# Altium schematic sheet Sheet1.SchDoc
size A; SheetNumber: 1; SheetTotal: 1
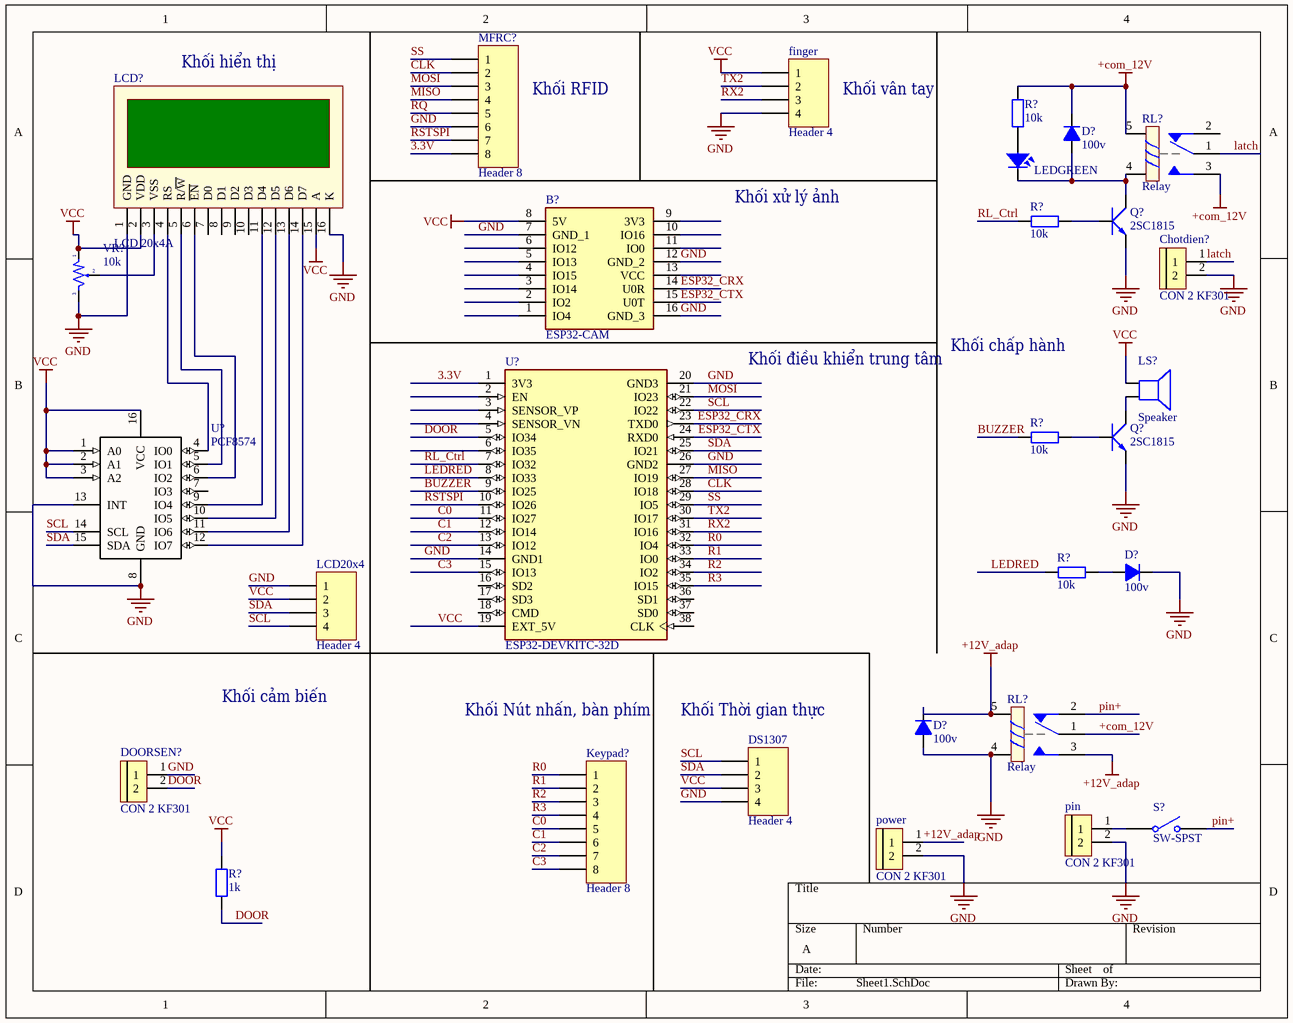
[diagram p0: Sheet1.SchDoc]

## Parts
(Parts that share a designator on the sheet are numbered #1, #2 ... from top to bottom, then left to right.)
B?  ESP32-CAM  [ESP32CAM]
Chotdien?  CON 2 KF301  [Con 2 KF301 5.08]
D?#1  100v  [DIODE 1A]
D?#2  100v  [DIODE 1A]
D?#3  100v  [DIODE 1A]
DOORSEN?  CON 2 KF301  [Con 2 KF301 5.08]
DS1307  Header 4  [HDR1X4]
finger  Header 4  [HDR1X4]
Keypad?  Header 8  [HDR1X8]
LCD20x4  Header 4  [HDR1X4]
LCD?  LCD 20x4A  [LCD20X4A]
LEDGREEN  LED  [LED-3MM-YELLOW]  (value not drawn)
LS?  Speaker  [SPEAKER]
MFRC?  Header 8  [HDR1X8]
pin  CON 2 KF301  [Con 2 KF301 5.08]
power  CON 2 KF301  [Con 2 KF301 5.08]
Q?#1  2SC1815  [TO92-123]
Q?#2  2SC1815  [TO92-123]
R?#1  10k  [tro vach 1w]
R?#2  10k  [tro vach 1w]
R?#3  10k  [tro vach 1w]
R?#4  10k  [tro vach 1w]
R?#5  1k  [tro vach 1w]
RL?#1  Relay  [Relay 5 Chan SRD]
RL?#2  Relay  [Relay 5 Chan SRD]
S?  SW-SPST  [SPST-2]
U?#1  PCF8574  [DIP16]
U?#2  ESP32-DEVKITC-32D  [MODULE_ESP32-DEVKITC-32D]
VR?  10k  [Bien Tro Volume Don]

## Nets
+12V_adap: D?#3.2(K) power.1 RL?#2.3 RL?#2.5
+com_12V: D?#1.2(K) R?#1.2 RL?#1.3 RL?#1.5 RL?#2.1
GND: B?.7(GND_1) B?.12(GND_2) B?.16(GND_3) Chotdien?.2 D?#2.2(K) D?#3.1(A) DOORSEN?.1 DS1307.4 finger.4 LCD20x4.1 LCD?.1(GND) LCD?.16(K) MFRC?.6 pin.2 power.2 Q?#1.1(E) Q?#2.1(E) RL?#2.4 U?#1.8(GND) U?#1.13(INT) U?#2.14(GND1) U?#2.20(GND3) U?#2.26(GND2) VR?.3
VCC: B?.8(5V) DS1307.3 finger.1 LCD20x4.2 LCD?.2(VDD) LCD?.15(A) LS?.1 R?#5.2 U?#1.1(A0) U?#1.2(A1) U?#1.3(A2) U?#1.16(VCC) U?#2.19(EXT_5V) VR?.1
3.3V: MFRC?.8 U?#2.1(3V3)
BUZZER: R?#3.1 U?#2.9(IO25)
C0: Keypad?.5 U?#2.11(IO27)
C1: Keypad?.6 U?#2.12(IO14)
C2: Keypad?.7 U?#2.13(IO12)
C3: Keypad?.8 U?#2.15(IO13)
CLK: MFRC?.2 U?#2.28(IO18)
DOOR: DOORSEN?.2 R?#5.1 U?#2.5(IO34)
ESP32_CRX: B?.14(U0R) U?#2.23(TXD0)
ESP32_CTX: B?.15(U0T) U?#2.24(RXD0)
latch: Chotdien?.1 RL?#1.1
LEDRED: R?#4.1 U?#2.8(IO33)
MISO: MFRC?.4 U?#2.27(IO19)
MOSI: MFRC?.3 U?#2.21(IO23)
pin+: RL?#2.2 S?.2(NO)
R0: Keypad?.1 U?#2.32(IO4)
R1: Keypad?.2 U?#2.33(IO0)
R2: Keypad?.3 U?#2.34(IO2)
R3: Keypad?.4 U?#2.35(IO15)
RL_Ctrl: R?#2.1 U?#2.7(IO32)
RQ: MFRC?.5
RSTSPI: MFRC?.7 U?#2.10(IO26)
RX2: finger.3 U?#2.31(IO16)
SCL: DS1307.1 LCD20x4.4 U?#1.14(SCL) U?#2.22(IO22)
SDA: DS1307.2 LCD20x4.3 U?#1.15(SDA) U?#2.25(IO21)
SS: MFRC?.1 U?#2.29(IO5)
TX2: finger.2 U?#2.30(IO17)
NetD?#1_1: D?#1.1(A) LEDGREEN.2 Q?#1.2(C) RL?#1.4
NetD?#2_1: D?#2.1(A) R?#4.2
NetLCD?_3: LCD?.3(VSS) VR?.2
NetLCD?_4: LCD?.4(RS) U?#1.4(IO0)
NetLCD?_5: LCD?.5(R/~{W}) U?#1.5(IO1)
NetLCD?_6: LCD?.6(~{EN}) U?#1.6(IO2)
NetLCD?_11: LCD?.11(D4) U?#1.9(IO4)
NetLCD?_12: LCD?.12(D5) U?#1.10(IO5)
NetLCD?_13: LCD?.13(D6) U?#1.11(IO6)
NetLCD?_14: LCD?.14(D7) U?#1.12(IO7)
NetLEDGREEN_1: LEDGREEN.1 R?#1.1
NetLS?_2: LS?.2 Q?#2.2(C)
Netpin_1: pin.1 S?.1(COMMON)
NetQ?#1_3: Q?#1.3(B) R?#2.2
NetQ?#2_3: Q?#2.3(B) R?#3.2

Not connected (* = marked no-connect by the designer): B? 1(IO4) 2(IO2) 3(IO14) 4(IO15) 5(IO13) 6(IO12) 9(3V3) 10(IO16) 11(IO0) 13(VCC); LCD? 7(D0) 8(D1) 9(D2) 10(D3); RL?#1 2; U?#1 7(IO3); U?#2 2(EN) 3(SENSOR_VP) 4(SENSOR_VN) 6(IO35) 16(SD2) 17(SD3) 18(CMD) 36(SD1) 37(SD0) 38(CLK)

## Notes on the sheet
- Khối hiển thị
- Khối RFID
- Khối vân tay
- Khối xử lý ảnh
- Khối điều khiển trung tâm
- Khối chấp hành
- Khối cảm biến
- Khối Nút nhấn, bàn phím
- (near DS1307) Khối Thời gian thực

## Library data of the parts
B? = ESP32-CAM: Modules PCBA Module RoHS; Manufacturer_Name: Ai-Thinker; Geometry.Height: 5mm; Manufacturer_Part_Number: ESP32-CAM; Mouser Part Number: *; Mouser Price/Stock: *; Arrow Part Number: *; Arrow Price/Stock: *; Datasheet Link: https://datasheet.lcsc.com/szlcsc/Ai-Thinker-ESP32-CAM_C277946.pdf
Chotdien? DOORSEN? pin power = CON 2 KF301: Cắm; Ma_Hang: MH000987; Ten_Linh_Kien: CON 2 KF301-2P 5.08MM Xanh Dương; Chung_Loai: Cắm; Ghi_Chu: *; Kieu_Chan: *; Don_Vi: Con
D?#1-D?#3 = Diode 1N4007: Cắm; Ten_Linh_Kien: Diode 1N4007 1A (DIP); Don_Vi: Con; Ma_Hang: MH001063; Ghi Chu: *; Kieu_Chan: *; Chung_Loai: Cắm
DS1307 finger LCD20x4 = Header 4: Header, 4-Pin; LatestRevisionDate: 17-Jul-2002; LatestRevisionNote: Re-released for DXP Platform.; Publisher: Altium Limited
Keypad? MFRC? = Header 8: Header, 8-Pin; LatestRevisionDate: 17-Jul-2002; LatestRevisionNote: Re-released for DXP Platform.; Publisher: Altium Limited
LCD? = LCD20x4A: LCD dipslay 20 char, 4 line; Value: Jum 40; Value: LCD 20x4A
LEDGREEN = LED: LED Single colour Green and Red; Value: LED 3 ly Single Colour
LS? = Speaker: Loudspeaker; Published: 24-Mar-1999; LatestRevisionDate: 17-Jul-2002; LatestRevisionNote: Re-released for DXP Platform.; PackageReference: PIN2; Publisher: Altium Limited
Q?#1 Q?#2 = 2SC1815: NPN 600mW, ECB; Value: C1815
R?#1-R?#4 = Tro Vach 1W 5% 10R: Cắm; Don_Vi: Con; So_Chan: 2; Ten_Linh_Kien: Trở 5% 1w 10R; Ma_Hang: MH006392; Chung_Loai: Cắm; Kieu_Chan: *
R?#5 = Tro Vach 1W 5% 1k: Cắm; Don_Vi: Con; So_Chan: 2; Ten_Linh_Kien: Trở 5% 1w 1k; Ma_Hang: MH006397; Chung_Loai: Cắm; Kieu_Chan: *
RL?#1 RL?#2 = Relay 5 Chan SRD: Relay 5 Chan; Ma_Hang: MH009374; Ten: Relay 5V10A SRD-05VDC-SL-C Chính Hãng
S? = SW-SPST: Single-Pole, Single-Throw Switch; Published: 24-Mar-1999; LatestRevisionDate: 17-Jul-2002; LatestRevisionNote: Re-released for DXP Platform.; PackageReference: SPST-2; Publisher: Altium Limited; PackageDescription: Switch; 2 Leads
U?#1 = PCF8574: I2C PORT EXPANDER; Manufacturer Part Number: PCF8574T/3,512; Manufacturer: NXP Semiconductors; Includes: POR; Interface: I²C; Interrupt Output: Yes; Number of I /O: 8; Voltage - Supply: 2.5 V ~ 6 V; Frequency - Clock: 100KHz; Supplier 1: Digi-Key; Supplier Part Number 1: 568-1076-5-ND; Package / Case: 16-SOIC (7.5mm Width); Category: Integrated Circuits (ICs); Supplier Part Number: 568-1076-5-ND; Operating Temperature: -40°C ~ 85°C; Packaging: Tube; RoHS: RoHS Compliant; Supplier: Digi-Key
U?#2 = ESP32-DEVKITC-32D: Eval Board For Esp-Wroom-32; Package: None; Availability: Unavailable; Value: *; MP: ESP32-DEVKITC-32D; Price: None
VR? = Triet Ap Don 5k: Cắm; Don_Vi: Con; Ten_Linh_Kien: Triết Áp Đơn B5K; Ma_Hang: MH001416; Kieu_Chan: *; Chung_Loai: Cắm